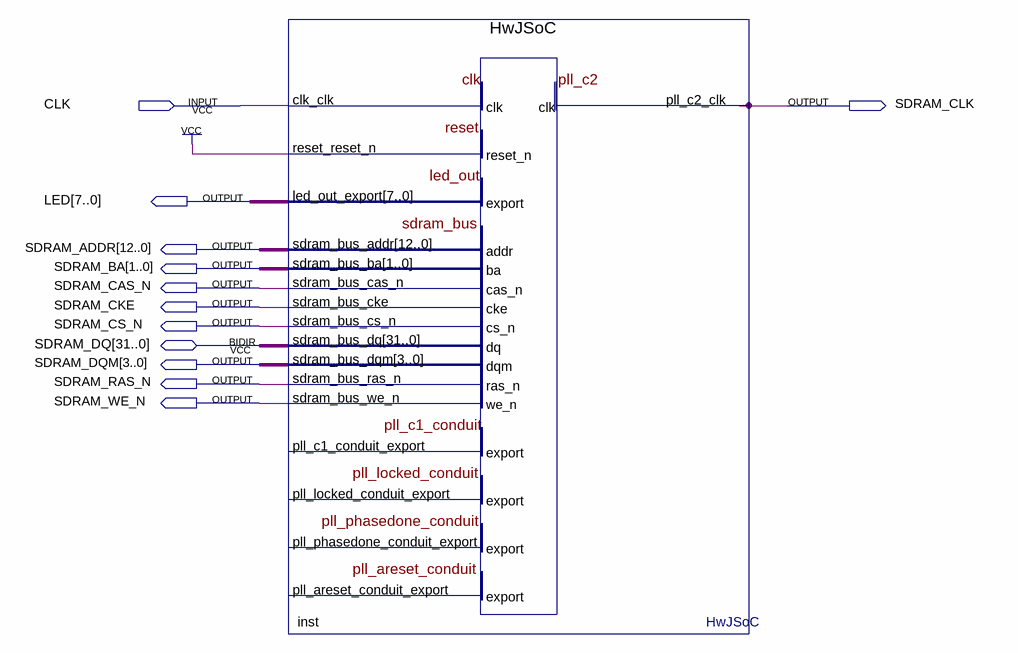
[diagram p0: schematic sheet]
// Quartus schematic TopLevel.bdf as structural Verilog: 1 symbols, 12 pins
module TopLevel (
  input  CLK,
  inout  [31:0] SDRAM_DQ,
  output SDRAM_CLK,
  output [7:0] LED,
  output [12:0] SDRAM_ADDR,
  output [1:0] SDRAM_BA,
  output SDRAM_CAS_N,
  output SDRAM_CKE,
  output SDRAM_CS_N,
  output [3:0] SDRAM_DQM,
  output SDRAM_RAS_N,
  output SDRAM_WE_N
);

  HwJSoC inst (
    .clk_clk(CLK), .reset_reset_n(1'b1), .pll_c2_clk(SDRAM_CLK), .led_out_export(LED),
    .sdram_bus_addr(SDRAM_ADDR), .sdram_bus_ba(SDRAM_BA), .sdram_bus_cas_n(SDRAM_CAS_N),
    .sdram_bus_cke(SDRAM_CKE), .sdram_bus_cs_n(SDRAM_CS_N), .sdram_bus_dqm(SDRAM_DQM),
    .sdram_bus_ras_n(SDRAM_RAS_N), .sdram_bus_we_n(SDRAM_WE_N), .sdram_bus_dq(SDRAM_DQ));  // open: pll_areset_conduit_export, pll_c1_conduit_export, pll_locked_conduit_export, pll_phasedone_conduit_export
endmodule
